# Altium schematic sheet [02] Block_diagram.SchDoc: Block diagram
size A3; Engineer: M. Folejewski; DocumentNumber: 2; SheetNumber: 2; SheetTotal: 15; PageSize: A4; Designators: 1-99
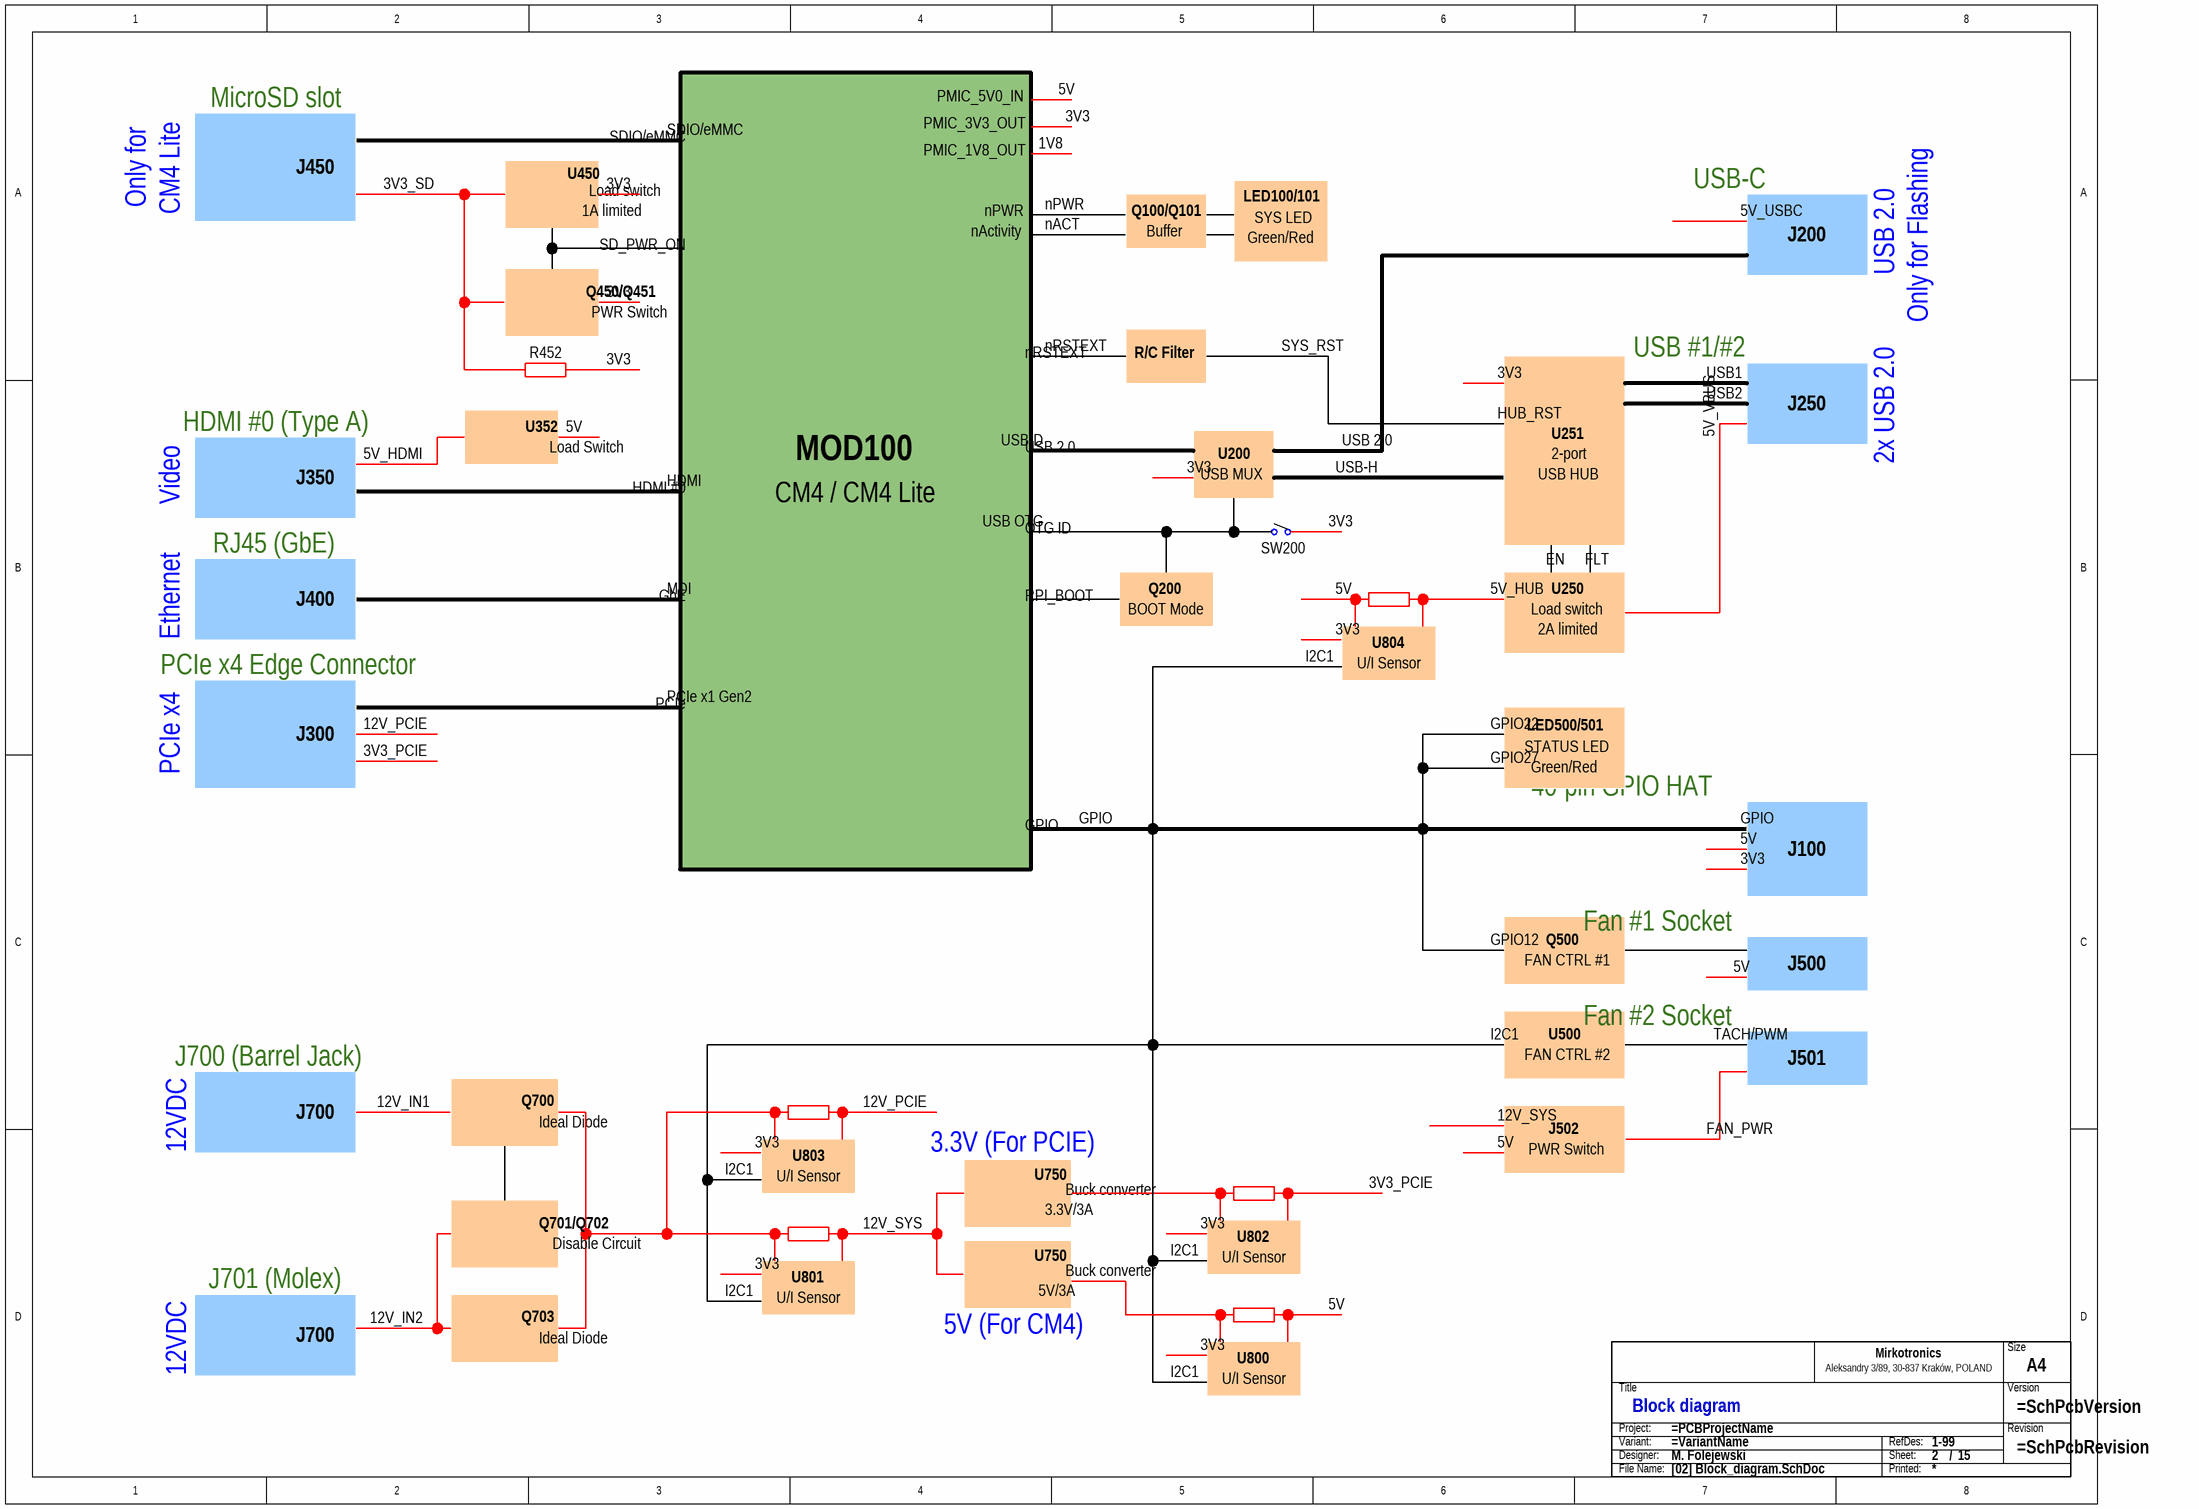
[diagram p0: [02] Block_diagram.SchDoc]

## Parts
TB?  Title block  (value not drawn)  (graphical)

## Notes on the sheet
- MicroSD slot
- PMIC_5V0_IN
- 5V
- J450
- U450
- SDIO/eMMC
- PMIC_3V3_OUT
- PMIC_1V8_OUT
- 1V8
- 3V3
- USB-C
- Only for
- CM4 Lite
- 3V3_SD
- 1A limited
- Load switch
- nActivity
- nPWR
- nACT
- Q100/Q101
- Buffer
- LED100/101
- Green/Red
- SYS LED
- 5V_USBC
- J200
- Q450/Q451
- PWR Switch
- SD_PWR_ON
- USB 2.0
- Only for Flashing
- R452
- nRSTEXT
- R/C Filter
- SYS_RST
- USB1
- USB #1/#2
- HDMI #0 (Type A)
- U352
- Load Switch
- USB-D
- HUB_RST
- U251
- USB2
- 5V_VBUS
- J250
- Video
- J350
- 5V_HDMI
- HDMI
- HDMI #0
- CM4 / CM4 Lite
- MOD100
- USB MUX
- U200
- USB-H
- USB HUB
- 2-port
- 2x USB 2.0
- RJ45 (GbE)
- OTG ID
- USB OTG
- SW200
- EN
- FLT
- Ethernet
- J400
- PCIe x4 Edge Connector
- MDI
- GbE
- RPI_BOOT
- BOOT Mode
- Q200
- U804
- 5V_HUB
- 2A limited
- U250
- PCIe x1 Gen2
- PCIe
- I2C1
- U/I Sensor
- PCIe x4
- J300
- 3V3_PCIE
- 12V_PCIE
- GPIO22
- GPIO27
- STATUS LED
- LED500/501
- 40-pin GPIO HAT
- GPIO
- J100
- Fan #1 Socket
- GPIO12
- FAN CTRL #1
- Q500
- Fan #2 Socket
- J500
- J700 (Barrel Jack)
- U500
- TACH/PWM
- J700
- 12V_IN1
- Q700
- Ideal Diode
- 12V_SYS
- FAN CTRL #2
- J501
- 12VDC
- U803
- 3.3V (For PCIE)
- U750
- J502
- FAN_PWR
- J701 (Molex)
- Q701/Q702
- Disable Circuit
- 3.3V/3A
- Buck converter
- U802
- 12V_IN2
- Q703
- U801
- 5V/3A
- 5V (For CM4)
- U800
- (in symbol SCH_TITLE_BLOCK_MIRKOTRONICS_V2) Size; Mirkotronics; Aleksandry 3/89, 30-837 Kraków, POLAND; Title; Version; Project:; Revision; Variant:; RefDes:; Designer:; Sheet:; /; File Name:; Printed:

## Library data of the parts
TB? = SCH_TITLE_BLOCK_MIRKOTRONICS_V2: Component Type: Title block; Manufacturer: -; Mounting Type: Non component; MPN: -; Operating Temperature: -; Package: -; Specification: Title block; Value: Title block; Replacement: -; System: ?